# EAGLE design Proto4_main_board (EAGLE 7.5.0)
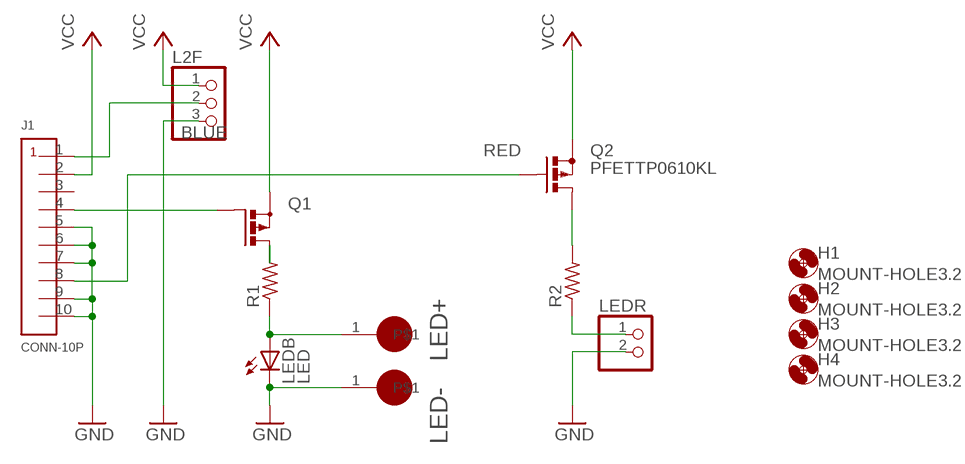
[diagram p0: schematic, sheet 1]

## Parts
H1  MOUNT-HOLE3.2  [3,2]
H2  MOUNT-HOLE3.2  [3,2]
H3  MOUNT-HOLE3.2  [3,2]
H4  MOUNT-HOLE3.2  [3,2]
J1  CONN-10P  [MICROMATCH-10P-SMD]
L2F  PINHD-1X3/90  [1X03/90]
LED+  TP  [LARGE_PAD]
LED-  TP  [LARGE_PAD]
LEDB  LED  [CREE-XP-E2]
LEDR  PINHD-1X2/90  [1X02/90]
Q1  PMOSFET_PTO220BH  [TO220BH]
Q2  PFETTP0610KL  [TO92-OVAL]
R1  R-US_0414/15  [0414/15]
R2  R-US_0309/12  [0309/12]

## Nets
BLUE: J1.4 Q1.G
GND: J1.5 J1.6 J1.7 J1.9 J1.10 L2F.3 LED-.1 LEDB.2(C) LEDR.2
N$1: Q1.D R1.2
N$2: LED+.1 LEDB.1(A) R1.1
N$3: Q2.3(D) R2.2
N$4: LEDR.1 R2.1
N$7: J1.1 L2F.2
RED: J1.8 Q2.2(G)
VCC: J1.2 L2F.1 Q1.S Q2.1(S)
Unconnected: J1.3

## Library data of the parts
H1-H4 = holes:MOUNT-HOLE: MOUNTING HOLE with drill center marker
J1 = LCAV:CONN-10P
L2F = pinhead:PINHD-1X3: PIN HEADER
LED+ LED- = LCAV:TP
LEDB = Robin:LED
LEDR = pinhead:PINHD-1X2: PIN HEADER
Q1 = transistor-power:PMOSFET_P: Power MOSFET P-Channel
Q2 = adafruit:PFET: P-CHANNEL MOS FET
R1 R2 = adafruit:R-US_: RESISTOR, American symbol

## Board
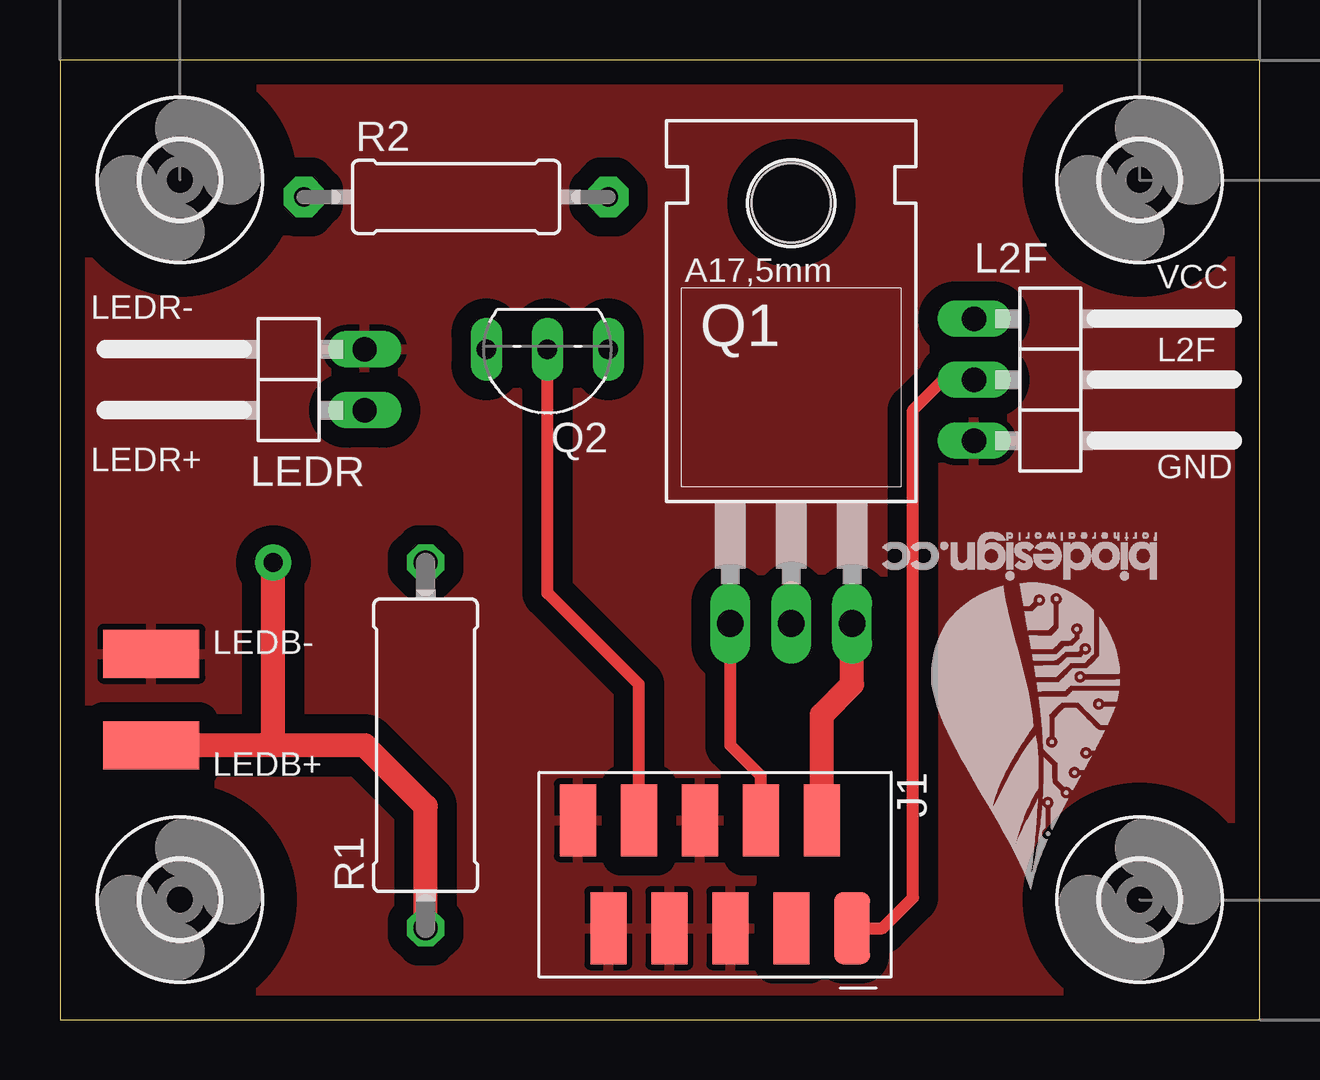
[diagram p1: board, top side]
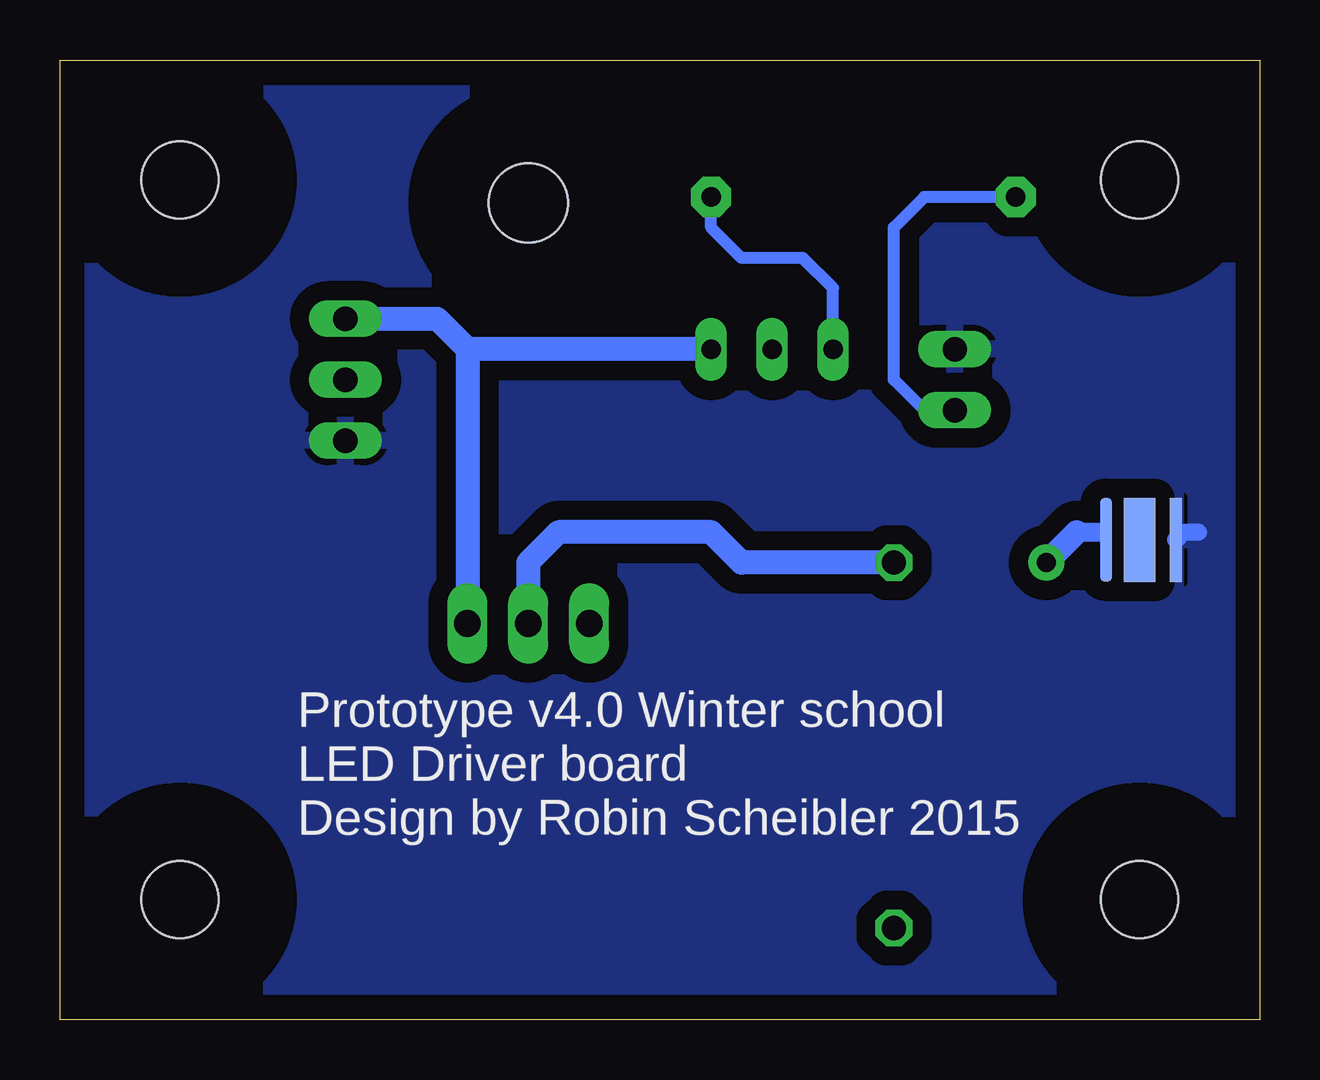
[diagram p2: board, bottom side, seen from below]

Size 50 x 40 mm. Coordinates in mm from the lower left corner, seen from the top.
Outline: 0,0 50,0 50,40 0,40 0,0
Copper layers (1*16): Top 0.035mm / dielectric 1.5mm / Bottom 0.035mm
Design rules "default": minimum track width 10mil, minimum drill 24mil, track to track 8mil, track to pad 8mil, pad to pad 8mil, via to via 8mil, smd to smd 8mil, copper to edge 40mil, drill to drill 8mil, minimum pad ring 10mil, minimum via ring 8mil, stop-mask expansion 4mil, vias tented up to drill 0mil, thermal gap 10mil

### Footprints (pad centres in the part's own frame; a part is rotated, then mirrored left to right if it is on the bottom)
3,2 = hole 3.2: 0,0
MICROMATCH-10P-SMD = smd 1.5 x 3: 1 0,0; 2 1.27,-4.5; 3 2.54,0; 4 3.81,-4.5; 5 5.08,0; 6 6.35,-4.5; 7 7.62,0; 8 8.89,-4.5; 9 10.16,0; 10 11.43,-4.5
1X03/90 = drill 1.016 long: 1 -2.54,-3.81; 2 0,-3.81; 3 2.54,-3.81
LARGE_PAD = smd 2 x 4: 1 0,0
CREE-XP-E2 = smd 0.5 x 3.5: 1 -1.4,0; 2 1.5,0 | smd 1.3 x 3.5: NC 0,0
1X02/90 = drill 1.016 long: 1 -1.27,-3.81; 2 1.27,-3.81
TO220BH = drill 1.118 long: D 0,-6.35; G -2.54,-6.35; S 2.54,-6.35 | hole 3.302: 0,11.176
TO92-OVAL = drill 0.813 long: 1 -2.54,0; 2 0,0; 3 2.54,0
0414/15 = drill 1.016 octagon: 1 -7.62,0; 2 7.62,0
0309/12 = drill 0.813 pad 1.676 octagon: 1 -6.35,0; 2 6.35,0

### Placement (x,y rotation side)
H1  5,5 0 top
H2  45,5 0 top
H3  5,35 0 top
H4  45,35 0 top
J1  33.02,3.81 180 top
L2F  41.91,26.67 270 top
LED+  3.81,11.43 90 top
LED-  3.81,15.24 90 top
LEDB  5,20 0 bottom
LEDR  8.89,26.67 90 top
Q1  30.48,22.86 0 top
Q2  20.32,27.94 180 top
R1  15.24,11.43 90 top
R2  16.51,34.29 0 top
U$1  [BIODESIGN-LOGO]  45.72,20.32 180 top

### Tracks (layer width: path | path; a pad name or v marks a point on that pad's centre or on a via)
BLUE
  Top 0.5: J1.4 29.21,10.16 27.94,11.43 Q1.G
GND
  Bottom 0.7: LEDB.2 3.18,20.32 2.54,20.32
  pour Top (isolate 0.8): -1.27,-1.27 52.07,-1.27 52.07,41.91 -1.27,41.91
  pour Bottom (isolate 0.8): -1.27,-1.27 50.8,-1.27 50.8,40.64 -1.27,40.64
N$1
  Top 1: Q1.D 30.48,17.78
  Bottom 1: R1.2 21.59,19.05 22.86,20.32 29.21,20.32 30.48,19.05 Q1.D
N$2  (via drill 0.8 pad 1.5)
  Top 1: 8.89,11.43 LED+.1 | 8.89,11.43 v8.89,19.05 | R1.1 15.24,8.89 12.7,11.43 8.89,11.43
  Bottom 0.5: 6.72,20.32 LEDB.1
  Bottom 0.8: 7.62,20.32 6.72,20.32
  Bottom 1: v8.89,19.05 7.62,20.32
N$3
  Bottom 0.5: Q2.3 17.78,30.48 19.05,31.75 21.59,31.75 22.86,33.02 R2.2
N$4
  Bottom 0.5: R2.1 13.97,34.29 15.24,33.02 15.24,26.67 13.97,25.4 LEDR.1
N$7
  Top 0.5: J1.1 34.29,3.81 35.56,5.08 35.56,25.4 36.83,26.67 L2F.2
RED
  Top 0.5: J1.8 24.13,13.97 20.32,17.78 Q2.2
VCC
  Top 1: J1.2 31.75,12.7 33.02,13.97 Q1.S
  Bottom 1: L2F.1 34.29,29.21 33.02,27.94 | 33.02,27.94 Q1.S | Q2.1 33.02,27.94

### Text on the board
tPlace: VCC | LEDR- | L2F | LEDR+ | GND | LEDB- | LEDB+
bPlace: Prototype v4.0 Winter school / LED Driver board / Design by Robin Scheibler 2015